# EAGLE design night-activated-switch (EAGLE 9.6.2)
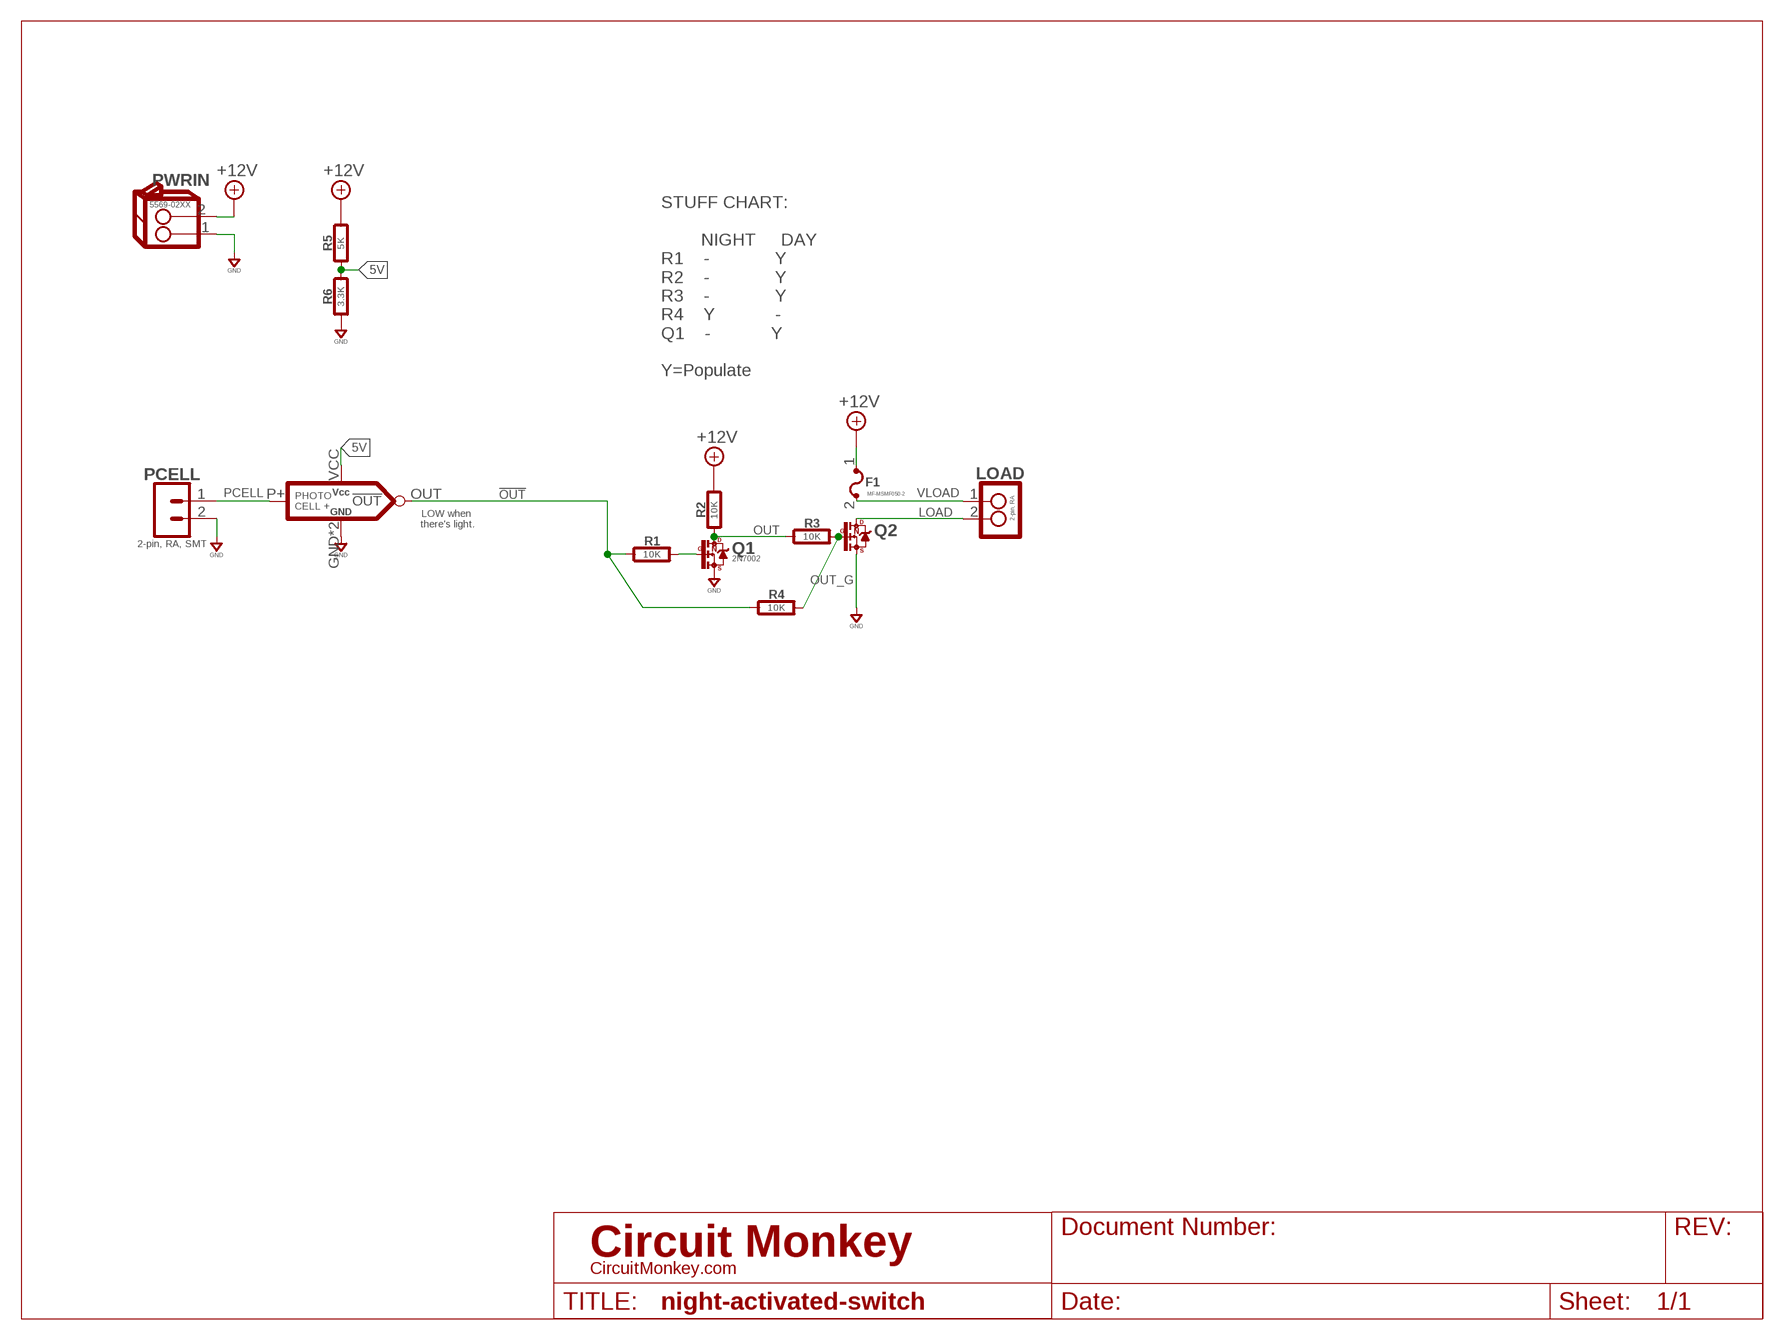
[diagram p0: schematic, sheet 1]

## Parts
F1  MF-MSMF050-2  FUSEBOURNS-MF-MSMF  [BOURNS-MF-MSMF]
LOAD  2-pin, RA  NANOFIT-02P-SR  [MOLEX-105313-XX02]
LS1  Light Sensor  LIGHT-SENSORB07QKJPWCG  [LIGHT-SENSOR-MODULE-B07QKJPWCG]
PCELL  2-pin, RA, SMT  02PRA-SMT  [S2B-PH-SM4-]
PWRIN  5569-02XX  MINIFIT-JR-02P-RA  [MOLEX-5569-02XX]
Q1  2N7002  N-FET_2N7002  [SOT-23]
Q2  N-FET_SI2318A  [SOT-23]
R1  10K  RESISTOR0603  [0603-RES]
R2  10K  RESISTOR0603  [0603-RES]
R3  10K  RESISTOR0603  [0603-RES]
R4  10K  RESISTOR0603  [0603-RES]
R5  5K  RESISTOR0603  [0603-RES]
R6  3.3K  RESISTOR0603  [0603-RES]

## Nets
5V: LS1.VCC R5.2 R6.1
!OUT: LS1.OUT R1.1 R4.1
+12V: F1.1 PWRIN.2 R2.1 R5.1
GND: LS1.GND LS1.P-(GND) PCELL.2 PWRIN.1 Q1.2(S) Q2.2(S) R6.2
LOAD: LOAD.2 Q2.3(D)
N$9: Q1.1(G) R1.2
OUT: Q1.3(D) R2.2 R3.1
OUT_G: Q2.1(G) R3.2 R4.2
PCELL: LS1.P+(CELL) PCELL.1
VLOAD: F1.2 LOAD.1

## Notes on the sheet
- STUFF CHART:
  
          NIGHT     DAY
  R1    -             Y
  R2    -             Y
  R3    -             Y
  R4    Y            -
  Q1    -            Y
  
  Y=Populate
- LOW when 
  there's light.

## Library data of the parts
F1 = fuse:FUSE: Fuse
LOAD = con-molex:NANOFIT-02P-SR: NanoFit Single Row 02P; MFR: Molex; MPN: 105313-xx02
LS1 = co-amazon:LIGHT-SENSOR: Photocel Light Sensor; COST01: 2.00; MFR: Amazon; MPN: B07QKJPWCG
PCELL = con-jst:02P: 2 pin connector; MFR: JST; MPN: S2B-PH-SM4
PWRIN = con-molex:MINIFIT-JR-02P: MiniFit Jr. 2-pin
Q1 = transistor-fet:N-FET: FET; COST01: 0.20; COST10: 0.16; COST100: 0.09; IDS: 0.2A; MPN: 2N7002; RDS: 0.05 ohm
Q2 = transistor-fet:N-FET: FET; COST01: 0.38; COST10: 0.30; COST100: 0.18; IGS: 5A; RDS: 0.45mOhms
R1-R6 = rlc:RESISTOR: Resistor

## Board
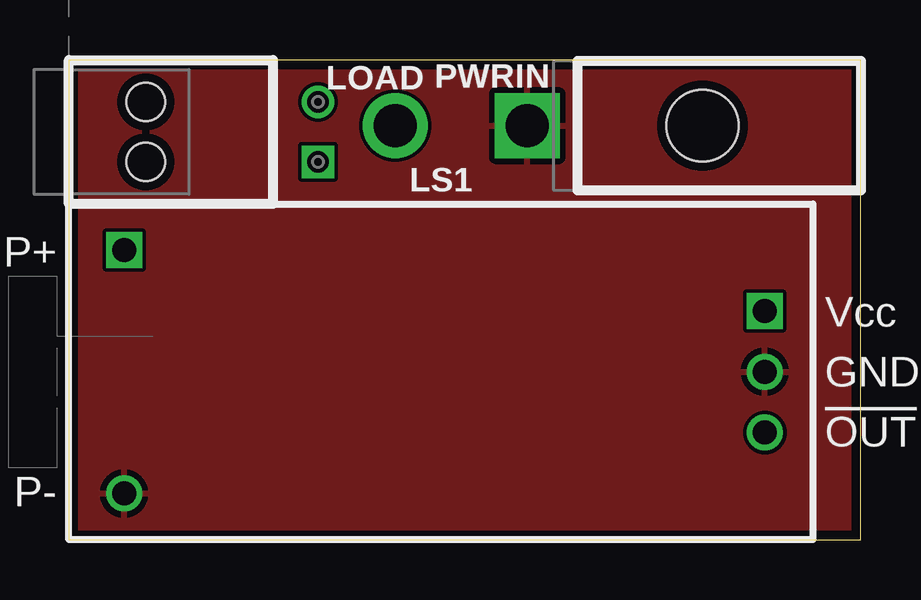
[diagram p1: board, top side]
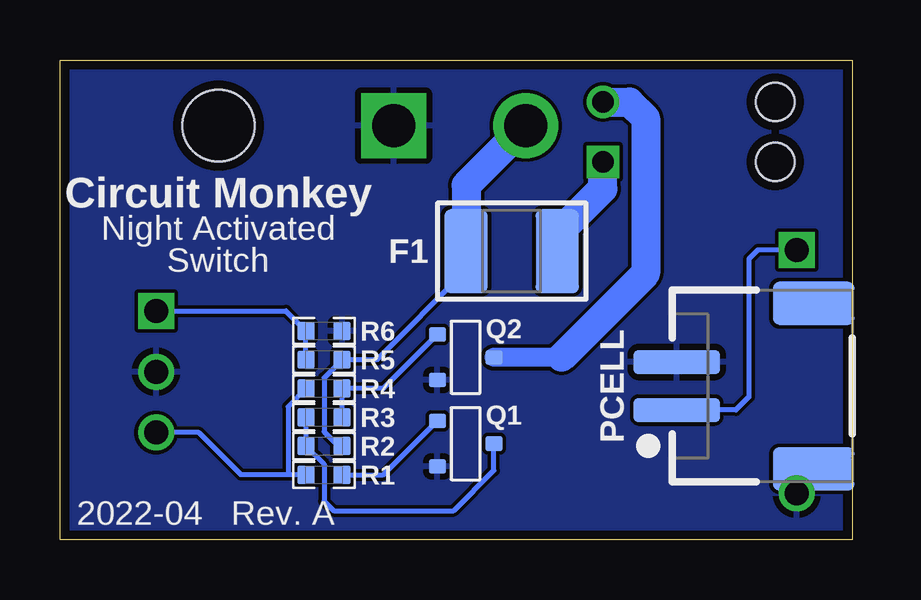
[diagram p2: board, bottom side, seen from below]

Size 33 x 20 mm. Coordinates in mm from the lower left corner, seen from the top.
Outline: 0,0 33,0 33,20 0,20 0,0
Copper layers (1*16): Top 0.0356mm / dielectric 1.5011mm / Bottom 0.0356mm
Design rules "OSH-CircuitMonkey": minimum track width 6mil, minimum drill 13mil, track to track 6mil, track to pad 6mil, pad to pad 6mil, via to via 6mil, smd to smd 6mil, copper to edge 15mil, drill to drill 6mil, minimum pad ring 7mil, minimum via ring 7mil, stop-mask expansion 3mil, vias tented up to drill 13mil, thermal gap 10mil

### Footprints (pad centres in the part's own frame; a part is rotated, then mirrored left to right if it is on the bottom)
BOURNS-MF-MSMF = smd 1.8 x 3.5: 1 -1.9,0; 2 1.9,0
MOLEX-105313-XX02 = drill 0.9 square: 1 7.18,-1.25 | drill 0.9: 2 7.18,1.25 | hole 1.6: 0,1.25; 0,-1.25
LIGHT-SENSOR-MODULE-B07QKJPWCG = drill 1: GND 13.5,0; OUT 13.5,-2.54; P- -13.2,-5.08 | drill 1 square: P+ -13.2,5.08; VCC 13.5,2.54
S2B-PH-SM4- = smd 1 x 3.6: 1 1,-7.3; 2 -1,-7.3 | smd 1.8 x 3.4: GND@MT1 3.45,-1.6; GND@MT2 -3.45,-1.6
MOLEX-5569-02XX = drill 1.8 square: 1 0,7.3 | drill 1.8: 2 0,12.8 | hole 3: 0,0
SOT-23 = smd 0.6 x 0.7: 1 -0.95,-1.18; 2 0.95,-1.18; 3 0,1.18
0603-RES = smd 0.711 x 0.762: 1 -0.752,0; 2 0.752,0

### Placement (x,y rotation side)
F1  14.18,12.03 0 bottom
LOAD  3.2,17 0 top
LS1  15.5,7 0 top
PCELL  0,6.4 270 bottom
PWRIN  26.4,17.26 90 top
Q1  16.1,4 270 bottom
Q2  16.1,7.6 270 bottom
R1  22,2.7 0 bottom
R2  22,3.9 180 bottom
R3  22,5.1 0 bottom
R4  22,6.3 0 bottom
R5  22,7.5 180 bottom
R6  22,8.7 0 bottom

### Tracks (layer width: path | path; a pad name or v marks a point on that pad's centre or on a via)
5V
  Bottom 0.2: LS1.VCC 23.59,9.54 R6.1 R5.2
!OUT
  Bottom 0.2: R1.1 23.5,2.7 | 23.5,2.7 25.45,2.7 27.21,4.46 LS1.OUT | R4.1 23.5,5.55 23.5,2.7
+12V
  Bottom 0.2: R2.1 21.4,3.9 22,4.5 22,6.75 R5.1 19.81,7.5 16.08,11.23 F1.1
  Bottom 1.2: PWRIN.2 16.08,14.78 F1.1
GND
  pour Top: 0,0 0,20 33,20 33,0
  pour Bottom: 0,0 0,20 33,20 33,0
LOAD
  Bottom 0.8: 12.1,7.6 Q2.3
  Bottom 1.2: LOAD.2 9.28,18.25 8.6,17.57 8.6,11.1 12.1,7.6
N$9
  Bottom 0.2: R1.2 19.53,2.7 Q1.1
OUT
  Bottom 0.2: R3.1 R2.2 22,3.15 22,1.6 21.6,1.2 16.6,1.2 14.92,2.88 Q1.3
OUT_G
  Bottom 0.2: Q2.1 19.53,6.3 R4.2 R3.2
PCELL
  Bottom 0.2: LS1.P+ 3.92,12.08 4.3,11.7 4.3,5.94 4.84,5.4 PCELL.1
VLOAD
  Bottom 1.2: F1.2 12.28,12.73 10.38,14.63 LOAD.1

### Text on the board
bPlace: Circuit Monkey | Night Activated / Switch | 2022-04 Rev. A